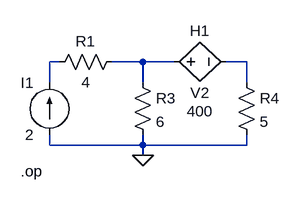
[diagram p0: schematic nodal7.asc]
nodal7.asc, the LTspice schematic file:
Version 4
SHEET 1 880 680
WIRE 16 112 0 112
WIRE 144 112 96 112
WIRE 192 112 144 112
WIRE 304 112 272 112
WIRE 0 144 0 112
WIRE 144 144 144 112
WIRE 304 144 304 112
WIRE 0 240 0 224
WIRE 144 240 144 224
WIRE 144 240 0 240
WIRE 304 240 304 224
WIRE 304 240 144 240
WIRE 144 256 144 240
FLAG 144 256 0
SYMBOL current 0 224 R180
WINDOW 0 24 80 Left 2
WINDOW 3 24 0 Left 2
WINDOW 123 0 0 Left 0
WINDOW 39 0 0 Left 0
SYMATTR InstName I1
SYMATTR Value 2
SYMBOL res 112 96 R90
WINDOW 0 0 56 VBottom 2
WINDOW 3 32 56 VTop 2
SYMATTR InstName R1
SYMATTR Value 4
SYMBOL res 128 128 R0
SYMATTR InstName R3
SYMATTR Value 6
SYMBOL res 288 128 R0
SYMATTR InstName R4
SYMATTR Value 5
SYMBOL h 176 112 R270
WINDOW 0 32 56 VTop 2
WINDOW 3 -32 56 VBottom 2
WINDOW 123 -60 56 VBottom 2
SYMATTR InstName H1
SYMATTR Value V2
SYMATTR Value2 400
TEXT -44 280 Left 2 !.op

The netlist it stands for:
* nodal7.asc
I1 0 N001 2
R1 N002 N001 4
R3 N002 0 6
R4 N003 0 5
H1 N002 N003 V2 400
.op
.backanno
.end